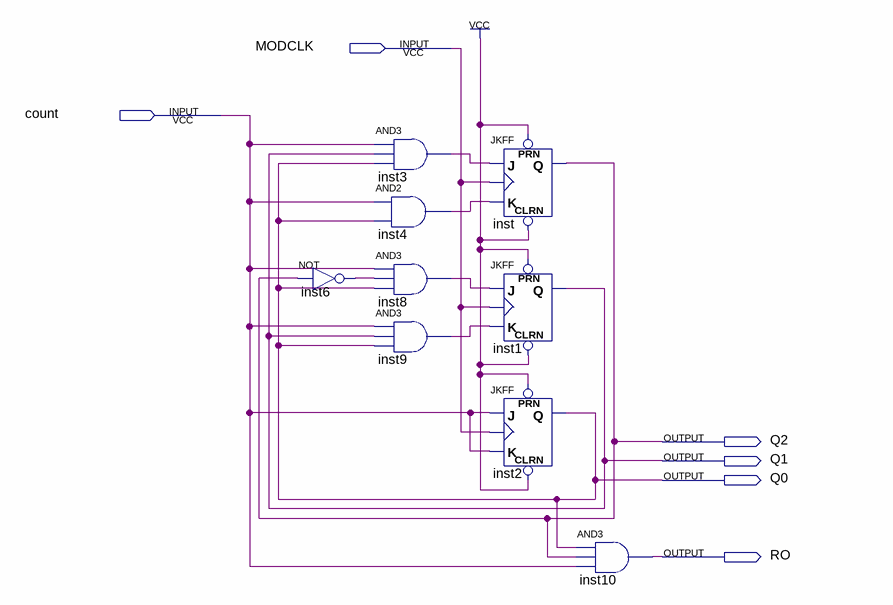
[diagram p0: schematic sheet]
// Quartus schematic MOD.bdf as structural Verilog: 9 symbols, 6 pins
module MOD (
  input  MODCLK,
  input  count,
  output Q2,
  output Q1,
  output Q0,
  output RO
);

  wire inst3_out, inst4_out, inst6_out, inst8_out, inst9_out;

  not inst6 (inst6_out, Q2);
  and inst3 (inst3_out, count, Q1, Q0);
  and inst4 (inst4_out, count, Q0);
  and inst8 (inst8_out, count, inst6_out, Q0);
  and inst9 (inst9_out, count, Q1, Q0);
  JKFF inst (.PRN(1'b1), .CLRN(1'b1), .K(inst4_out), .J(inst3_out), .CLK(MODCLK), .Q(Q2));
  JKFF inst1 (.PRN(1'b1), .CLRN(1'b1), .K(inst9_out), .J(inst8_out), .CLK(MODCLK), .Q(Q1));
  JKFF inst2 (.PRN(1'b1), .CLRN(1'b1), .K(count), .J(count), .CLK(MODCLK), .Q(Q0));
  and inst10 (RO, Q0, Q2, count);
endmodule
